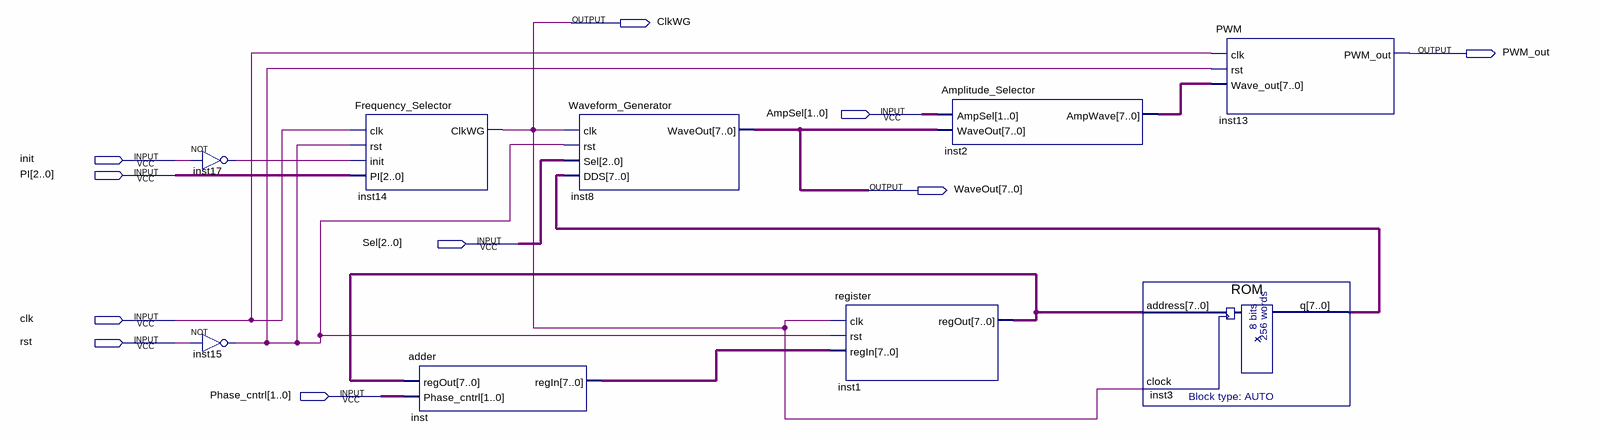
[diagram p0: schematic sheet]
// Quartus schematic function_generator.bdf as structural Verilog: 9 symbols, 10 pins
module function_generator (
  input  [1:0] AmpSel,
  input  init,
  input  [2:0] PI,
  input  [2:0] Sel,
  input  clk,
  input  rst,
  input  [1:0] Phase_cntrl,
  output ClkWG,
  output PWM_out,
  output [7:0] WaveOut
);

  wire inst15_out, inst17_out;
  wire [7:0] inst1_regout, inst2_ampwave, inst3_q, inst_regin;

  not inst17 (inst17_out, init);
  not inst15 (inst15_out, rst);
  Frequency_Selector inst14 (.clk(clk), .rst(inst15_out), .init(inst17_out), .PI(PI), .ClkWG(ClkWG));
  adder inst (.regOut(inst1_regout), .Phase_cntrl(Phase_cntrl), .regIn(inst_regin));
  Waveform_Generator inst8 (.clk(ClkWG), .rst(inst15_out), .Sel(Sel), .DDS(inst3_q), .WaveOut(WaveOut));
  register inst1 (.clk(ClkWG), .rst(inst15_out), .regIn(inst_regin), .regOut(inst1_regout));
  Amplitude_Selector inst2 (.AmpSel(AmpSel), .WaveOut(WaveOut), .AmpWave(inst2_ampwave));
  ROM inst3 (.address(inst1_regout), .clock(ClkWG), .q(inst3_q));
  PWM inst13 (.clk(clk), .rst(inst15_out), .Wave_out(inst2_ampwave), .PWM_out(PWM_out));
endmodule
